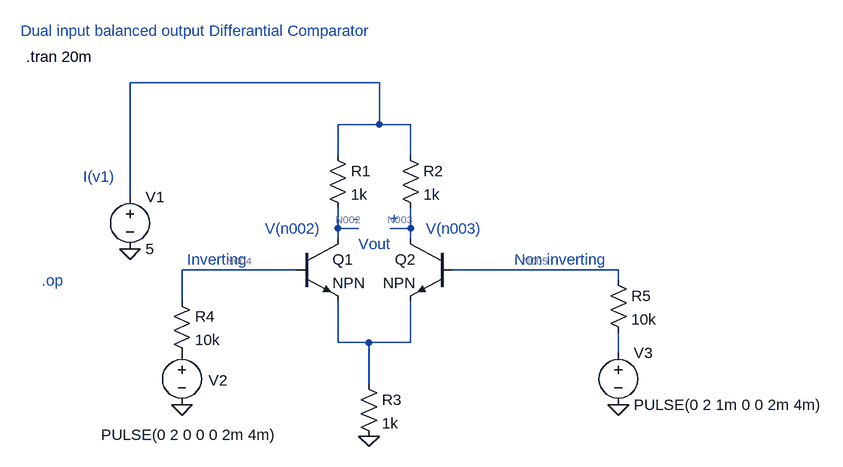
[diagram p0: schematic diff_comparator.asc]
diff_comparator.asc, the LTspice schematic file:
Version 4.1
SHEET 1 880 680
WIRE 144 -176 -240 -176
WIRE 144 -112 144 -176
WIRE 144 -112 80 -112
WIRE 192 -112 144 -112
WIRE 80 -64 80 -112
WIRE 192 -64 192 -112
WIRE -240 0 -240 -176
WIRE 80 48 80 16
WIRE 112 48 80 48
WIRE 192 48 192 16
WIRE 192 48 160 48
WIRE 80 64 80 48
WIRE 192 64 192 48
WIRE 16 112 -160 112
WIRE 512 112 256 112
WIRE 512 128 512 112
WIRE -160 160 -160 112
WIRE 80 224 80 160
WIRE 128 224 80 224
WIRE 192 224 192 160
WIRE 192 224 128 224
WIRE 512 240 512 208
WIRE 128 288 128 224
FLAG -160 320 0
FLAG -240 80 0
FLAG 512 320 0
FLAG 128 368 0
SYMBOL npn 16 64 R0
SYMATTR InstName Q1
SYMBOL npn 256 64 M0
SYMATTR InstName Q2
SYMBOL res 64 -80 R0
SYMATTR InstName R1
SYMATTR Value 1k
SYMBOL res 176 -80 R0
SYMATTR InstName R2
SYMATTR Value 1k
SYMBOL voltage -240 -16 R0
WINDOW 123 0 0 Left 0
WINDOW 39 0 0 Left 0
SYMATTR InstName V1
SYMATTR Value 5
SYMBOL voltage -160 224 R0
WINDOW 0 41 58 Left 2
WINDOW 3 -124 142 Left 2
WINDOW 123 0 0 Left 0
WINDOW 39 0 0 Left 0
SYMATTR InstName V2
SYMATTR Value PULSE(0 2 0 0 0 2m 4m)
SYMBOL voltage 512 224 R0
WINDOW 123 0 0 Left 0
WINDOW 39 0 0 Left 0
SYMATTR InstName V3
SYMATTR Value PULSE(0 2 1m 0 0 2m 4m)
SYMBOL res 112 272 R0
SYMATTR InstName R3
SYMATTR Value 1k
SYMBOL res -176 144 R0
SYMATTR InstName R4
SYMATTR Value 10k
SYMBOL res 496 112 R0
SYMATTR InstName R5
SYMATTR Value 10k
TEXT -400 -216 Left 2 !.tran 20m
TEXT 216 48 Left 2 ;V(n003)
TEXT -32 48 Left 2 ;V(n002)
TEXT -312 -32 Left 2 ;I(v1)
TEXT 352 96 Left 2 ;Non inverting
TEXT -152 96 Left 2 ;Inverting
TEXT -408 -256 Left 2 ;Dual input balanced output Differantial Comparator
TEXT 112 72 Left 2 ;Vout
TEXT 160 32 Left 2 ;+
TEXT 104 32 Left 2 ;-
TEXT -376 128 Left 2 ;.op

The netlist it stands for:
* diff_comparator.asc
Q1 N002 N004 N006 0 NPN
Q2 N003 N005 N006 0 NPN
R1 N001 N002 1k
R2 N001 N003 1k
V1 N001 0 5
V2 P001 0 PULSE(0 2 0 0 0 2m 4m)
V3 N007 0 PULSE(0 2 1m 0 0 2m 4m)
R3 N006 0 1k
R4 N004 P001 10k
R5 N005 N007 10k
.model NPN NPN
.model PNP PNP
.lib standard.bjt
.tran 20m
* V(n003)
* V(n002)
* I(v1)
* Non inverting
* Inverting
* Dual input balanced output Differantial Comparator
* Vout
* +
* -
* .op
.backanno
.end

* Results of the author's LTspice run, read from the files saved beside the schematic
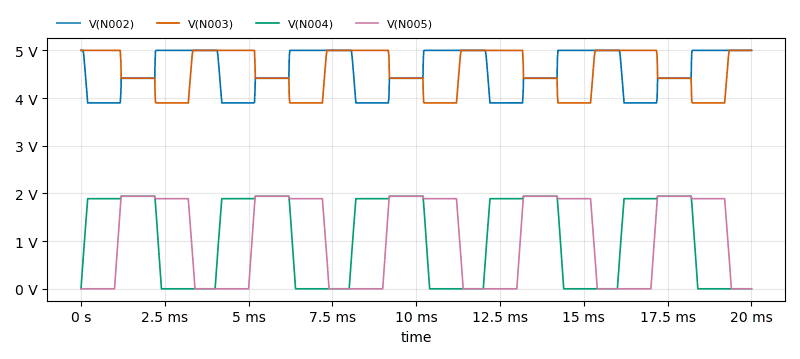
[diagram p1: Transient Analysis of diff_comparator.asc, plotted from the saved traces]
* Transient Analysis, 1 run:
*   V(N002): min 3.898 V, max 5 V, average 4.561 V, rms 4.583 V, last 5 V
*   V(N003): min 3.898 V, max 5 V, average 4.56 V, rms 4.583 V, last 5 V
*   V(N004): min 0 V, max 1.942 V, average 1.056 V, rms 1.406 V, last 0 V
*   V(N005): min 0 V, max 1.942 V, average 1.056 V, rms 1.406 V, last 0 V